# EAGLE design microstrip-test-4-layer-sma-36-38 (EAGLE 9.2.2)
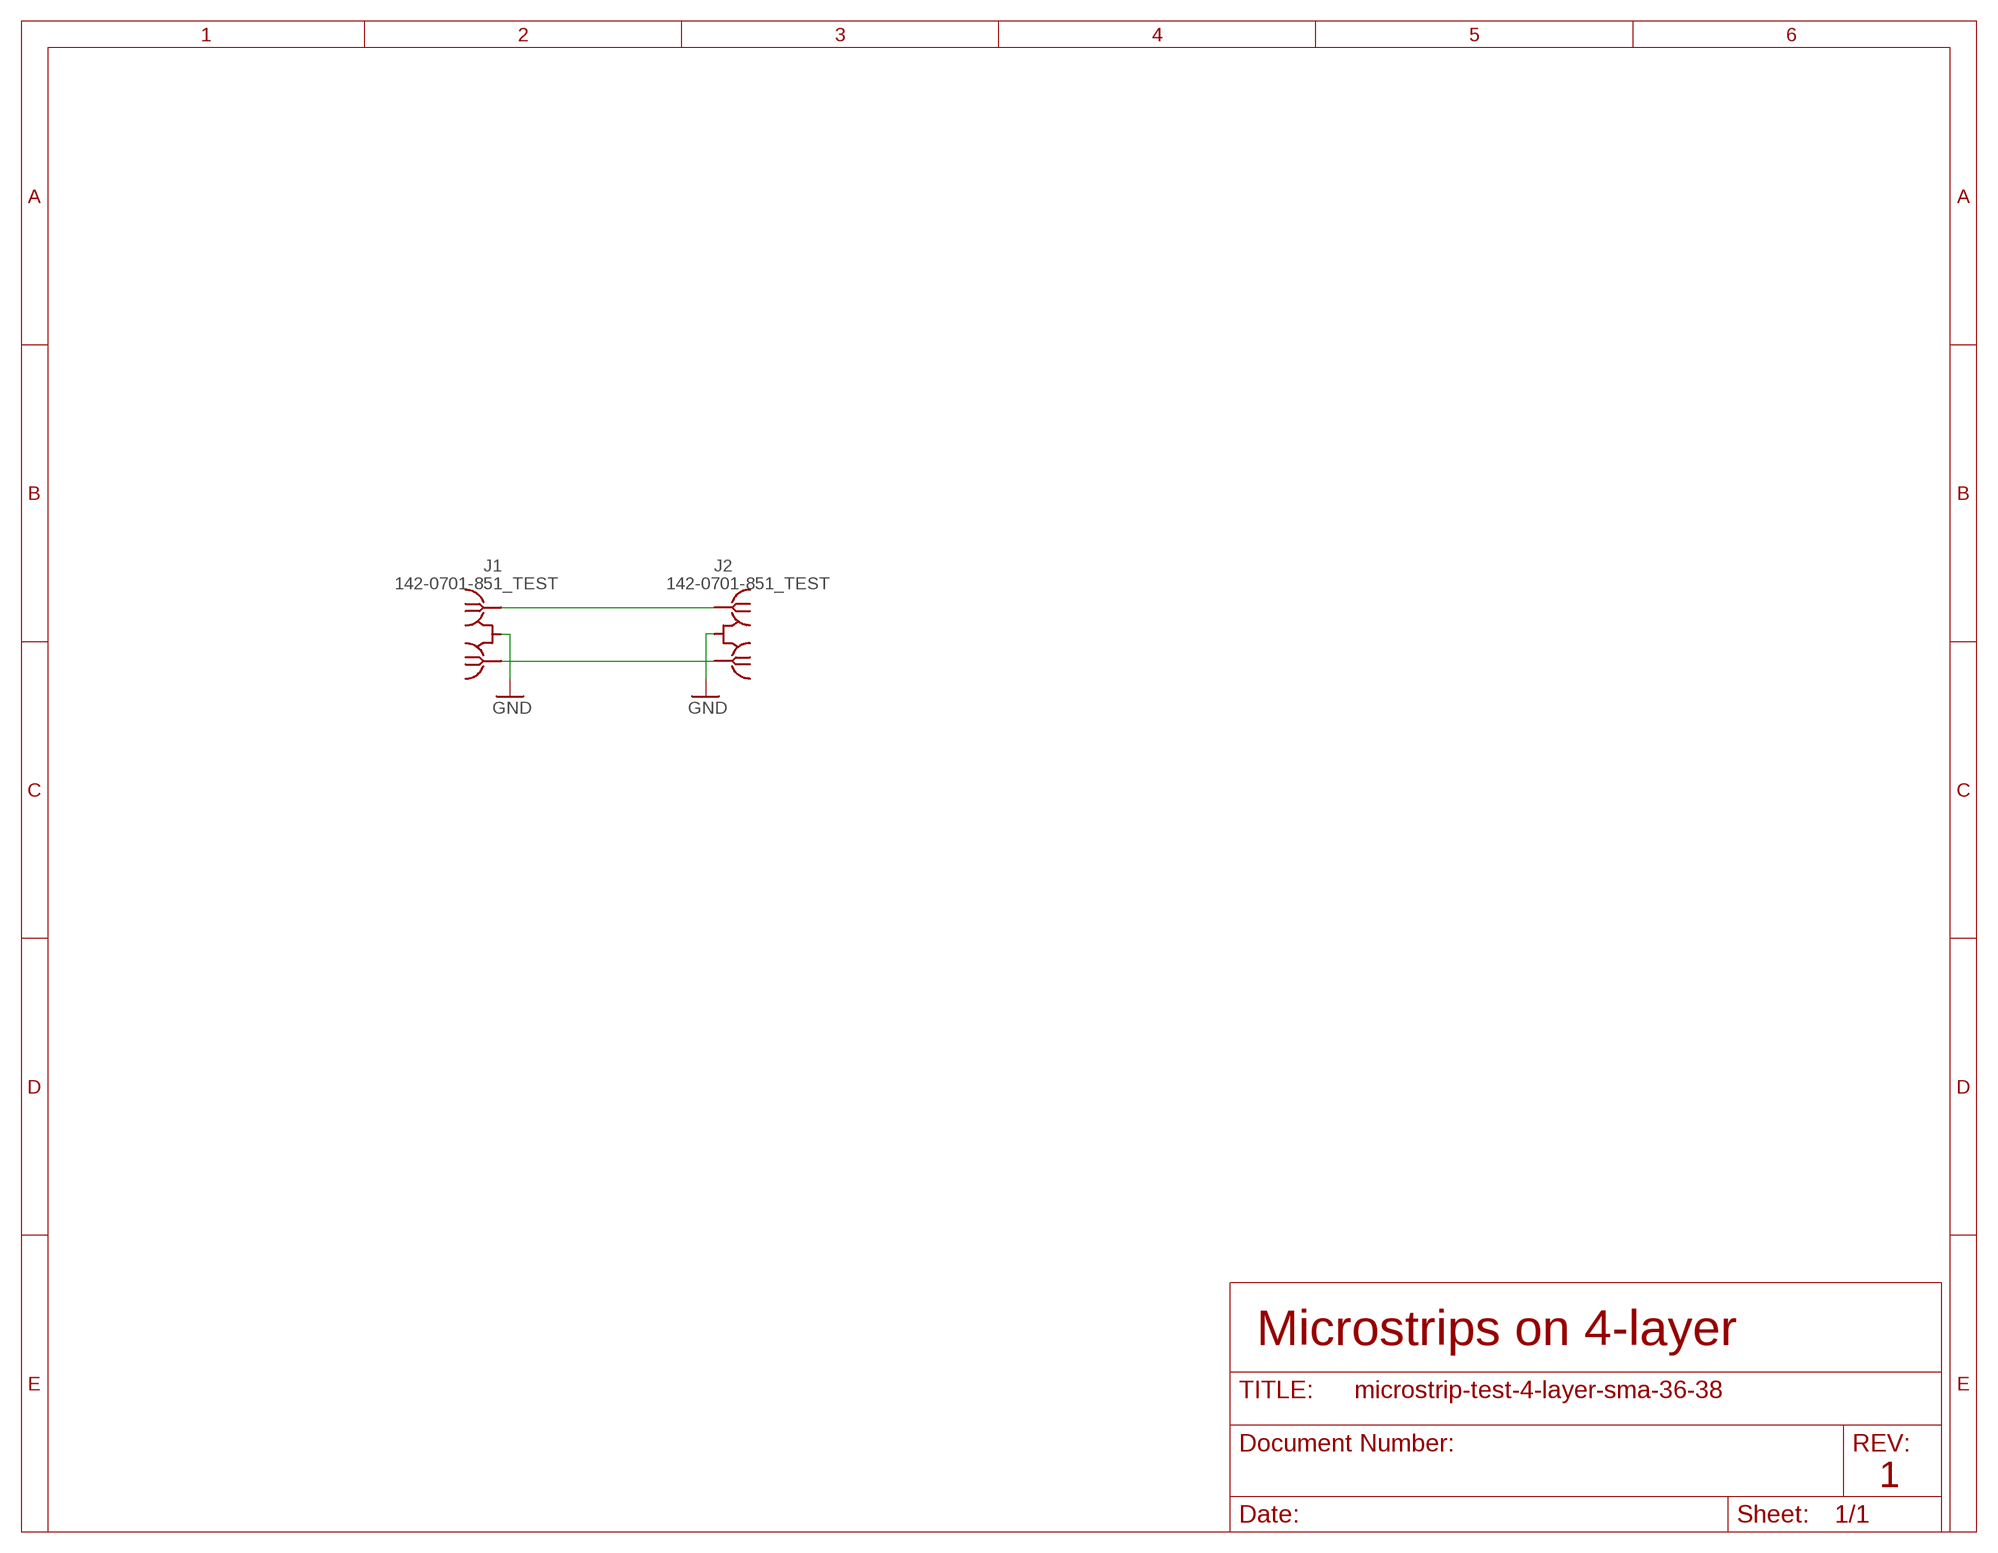
[diagram p0: schematic, sheet 1]

## Parts
J1  142-0701-851_TEST  [142-0701-851_TEST]
J2  142-0701-851_TEST  [142-0701-851_TEST]

## Nets
GND: J1.GND1(GND) J1.GND2(GND) J1.GND3(GND) J1.GND4(GND) J2.GND1(GND) J2.GND2(GND) J2.GND3(GND) J2.GND4(GND)
RF_BOT [RF]: J1.RF2 J2.RF2
RF_TOP [RF]: J1.RF1 J2.RF1

## Notes on the sheet
- Microstrips on 4-layer
- 1

## Library data of the parts
J1 J2 = J-Cinch-142-0701-851-SMA-end-launch:142-0701-851_TEST

## Net classes
1 RF: clearance 0.8 mm

## Board
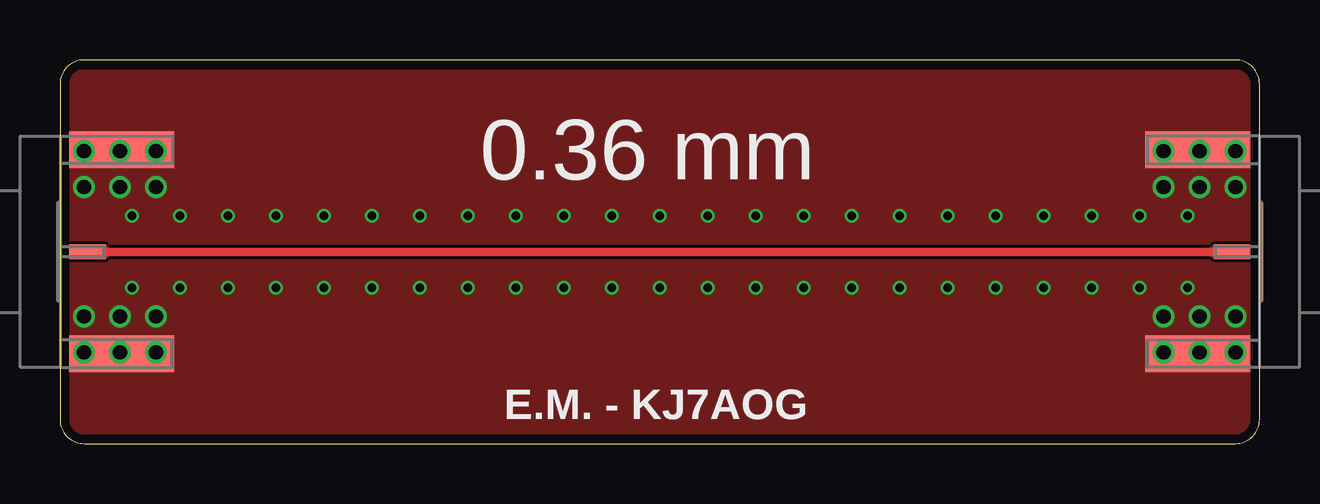
[diagram p1: board, top side]
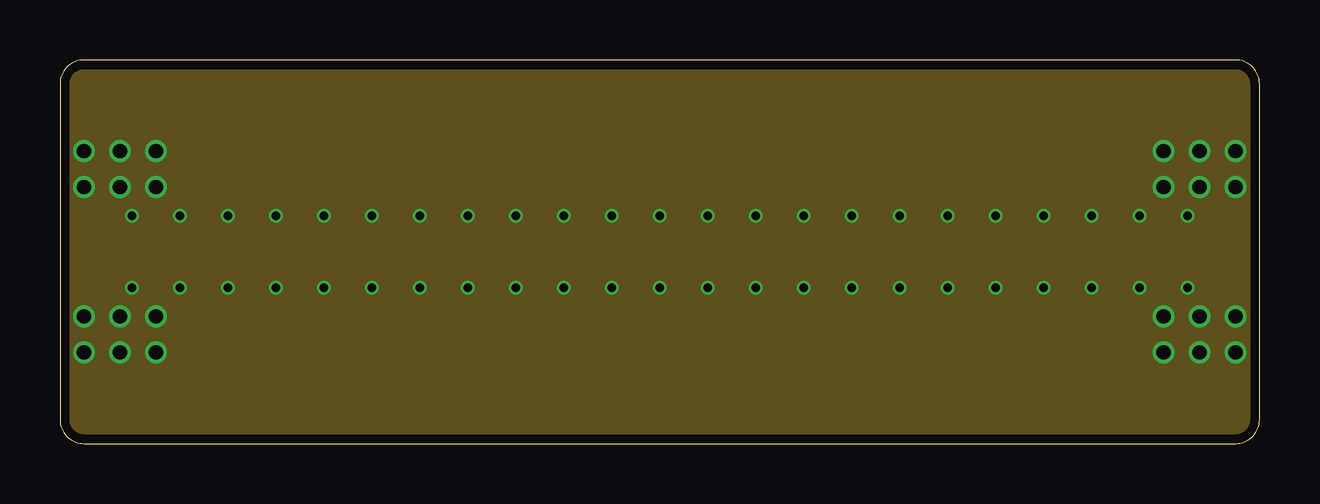
[diagram p2: board, inner layer Route2]
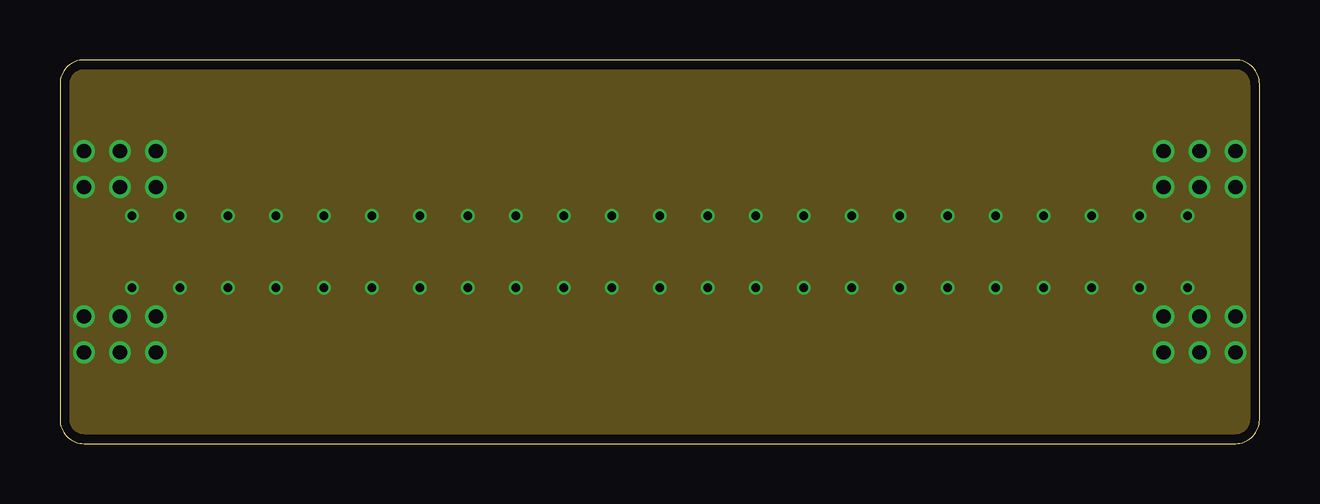
[diagram p3: board, inner layer Route15]
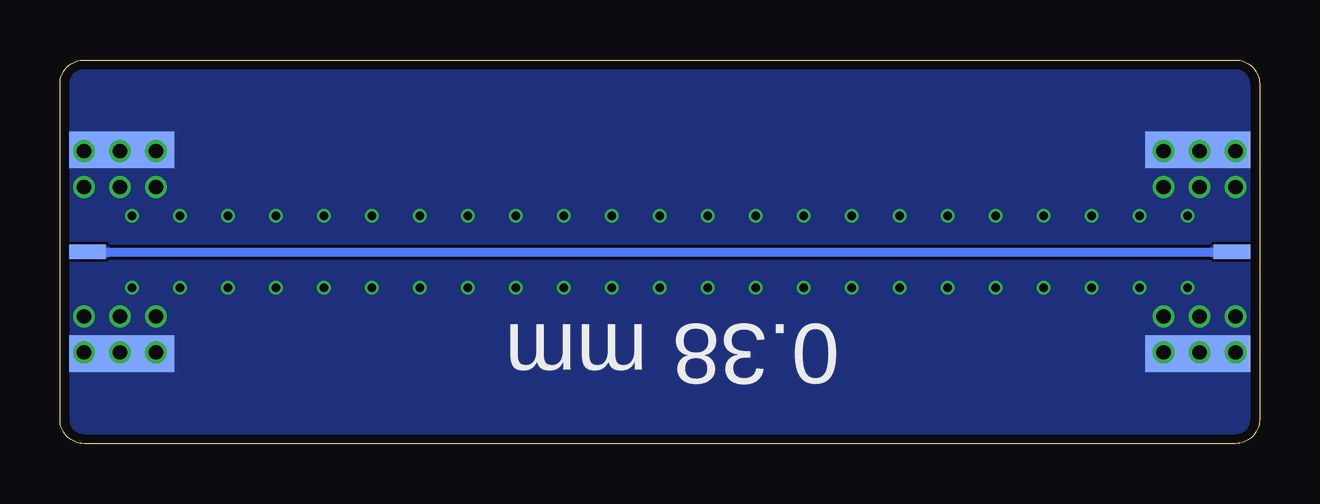
[diagram p4: board, bottom side, seen from below]

Size 50 x 16 mm. Coordinates in mm from the lower left corner, seen from the top.
Outline: 0,15 0,1 arc90 1,0 49,0 arc90 50,1 50,15 arc90 49,16 1,16 arc90 0,15
Copper layers (1*2*15*16): Top 0.035559375mm / dielectric 0.17018125mm / Route2 0.01778125mm / dielectric 47mil / Route15 0.01778125mm / dielectric 0.17018125mm / Bottom 0.035559375mm
Design rules "oshpark-4layer-tented *": minimum track width 5mil, minimum drill 10mil, track to track 5mil, track to pad 5mil, pad to pad 5mil, via to via 5mil, smd to smd 5mil, copper to edge 15mil, drill to drill 6mil, minimum pad ring 4mil, minimum via ring 4mil, stop-mask expansion 2.5mil, vias tented up to drill 20mil, thermal gap 10mil

### Footprints (pad centres in the part's own frame; a part is rotated, then mirrored left to right if it is on the bottom)
142-0701-851_TEST = smd 1.524 x 4.37: GND1 -4.255,-2.566; GND2 4.255,-2.566 | smd 1.524 x 4.37 bottom: GND3 -4.255,-2.566; GND4 4.255,-2.566 | smd 0.6 x 1.53: RF1 0,-1.146 | smd 0.6 x 1.53 bottom: RF2 0,-1.146

### Placement (x,y rotation side)
J1  0,8 90 top
J2  50,8 270 top

### Tracks (layer width: path | path; a pad name or v marks a point on that pad's centre or on a via)
GND  (via drill 0.35 pad 0.35, 0.6 pad 0.35)
  other vias: 1,3.8 2.5,3.8 4,3.8 3,6.5 5,6.5 7,6.5 9,6.5 11,6.5 13,6.5 15,6.5 17,6.5 19,6.5 21,6.5 23,6.5 25,6.5 27,6.5 29,6.5 1,12.2 2.5,12.2 4,12.2 31,6.5 33,6.5 35,6.5 37,6.5 39,6.5 41,6.5 43,6.5 45,6.5 47,6.5 5,9.5 7,9.5 9,9.5 11,9.5 13,9.5 15,9.5 17,9.5 19,9.5 21,9.5 23,9.5 25,9.5 27,9.5 29,9.5 31,9.5 3,9.5 33,9.5 35,9.5 37,9.5 39,9.5 41,9.5 43,9.5 45,9.5 47,9.5 46,12.2 47.5,12.2 49,12.2 46,3.8 47.5,3.8 49,3.8 46,5.3 47.5,5.3 49,5.3 46,10.7 47.5,10.7 49,10.7 1,5.3 2.5,5.3 4,5.3 1,10.7 2.5,10.7 4,10.7
  pour Top (no thermals): 0,16 0,10.6 0,5.4 0,0 50,0 50,5.4 50,10.6 50,16
  pour Route2: 0,16 0,0 50,0 50,16
  pour Bottom (no thermals): 0,16 0,0 50,0 50,16
  pour Route15: 0,16 0,0 50,0 50,16
RF_BOT
  Bottom 0.38: J2.RF2 J1.RF2
  pour Bottom (no thermals): 1.83,8.28 1.95,8.28 2.23,8 1.95,7.72 1.83,7.72
  pour Bottom (no thermals): 48.17,7.72 48.05,7.72 47.77,8 48.05,8.28 48.17,8.28
RF_TOP
  Top 0.36: J1.RF1 J2.RF1
  pour Top (no thermals): 1.83,8.28 1.95,8.28 2.23,8 1.95,7.72 1.83,7.72
  pour Top (no thermals): 48.17,7.72 48.05,7.72 47.77,8 48.05,8.28 48.17,8.28

### Text on the board
tPlace: 0.36 mm | E.M. - KJ7AOG
bPlace: 0.38 mm